# EAGLE schematic BMS Segment rev10 (EAGLE 9.2.2)
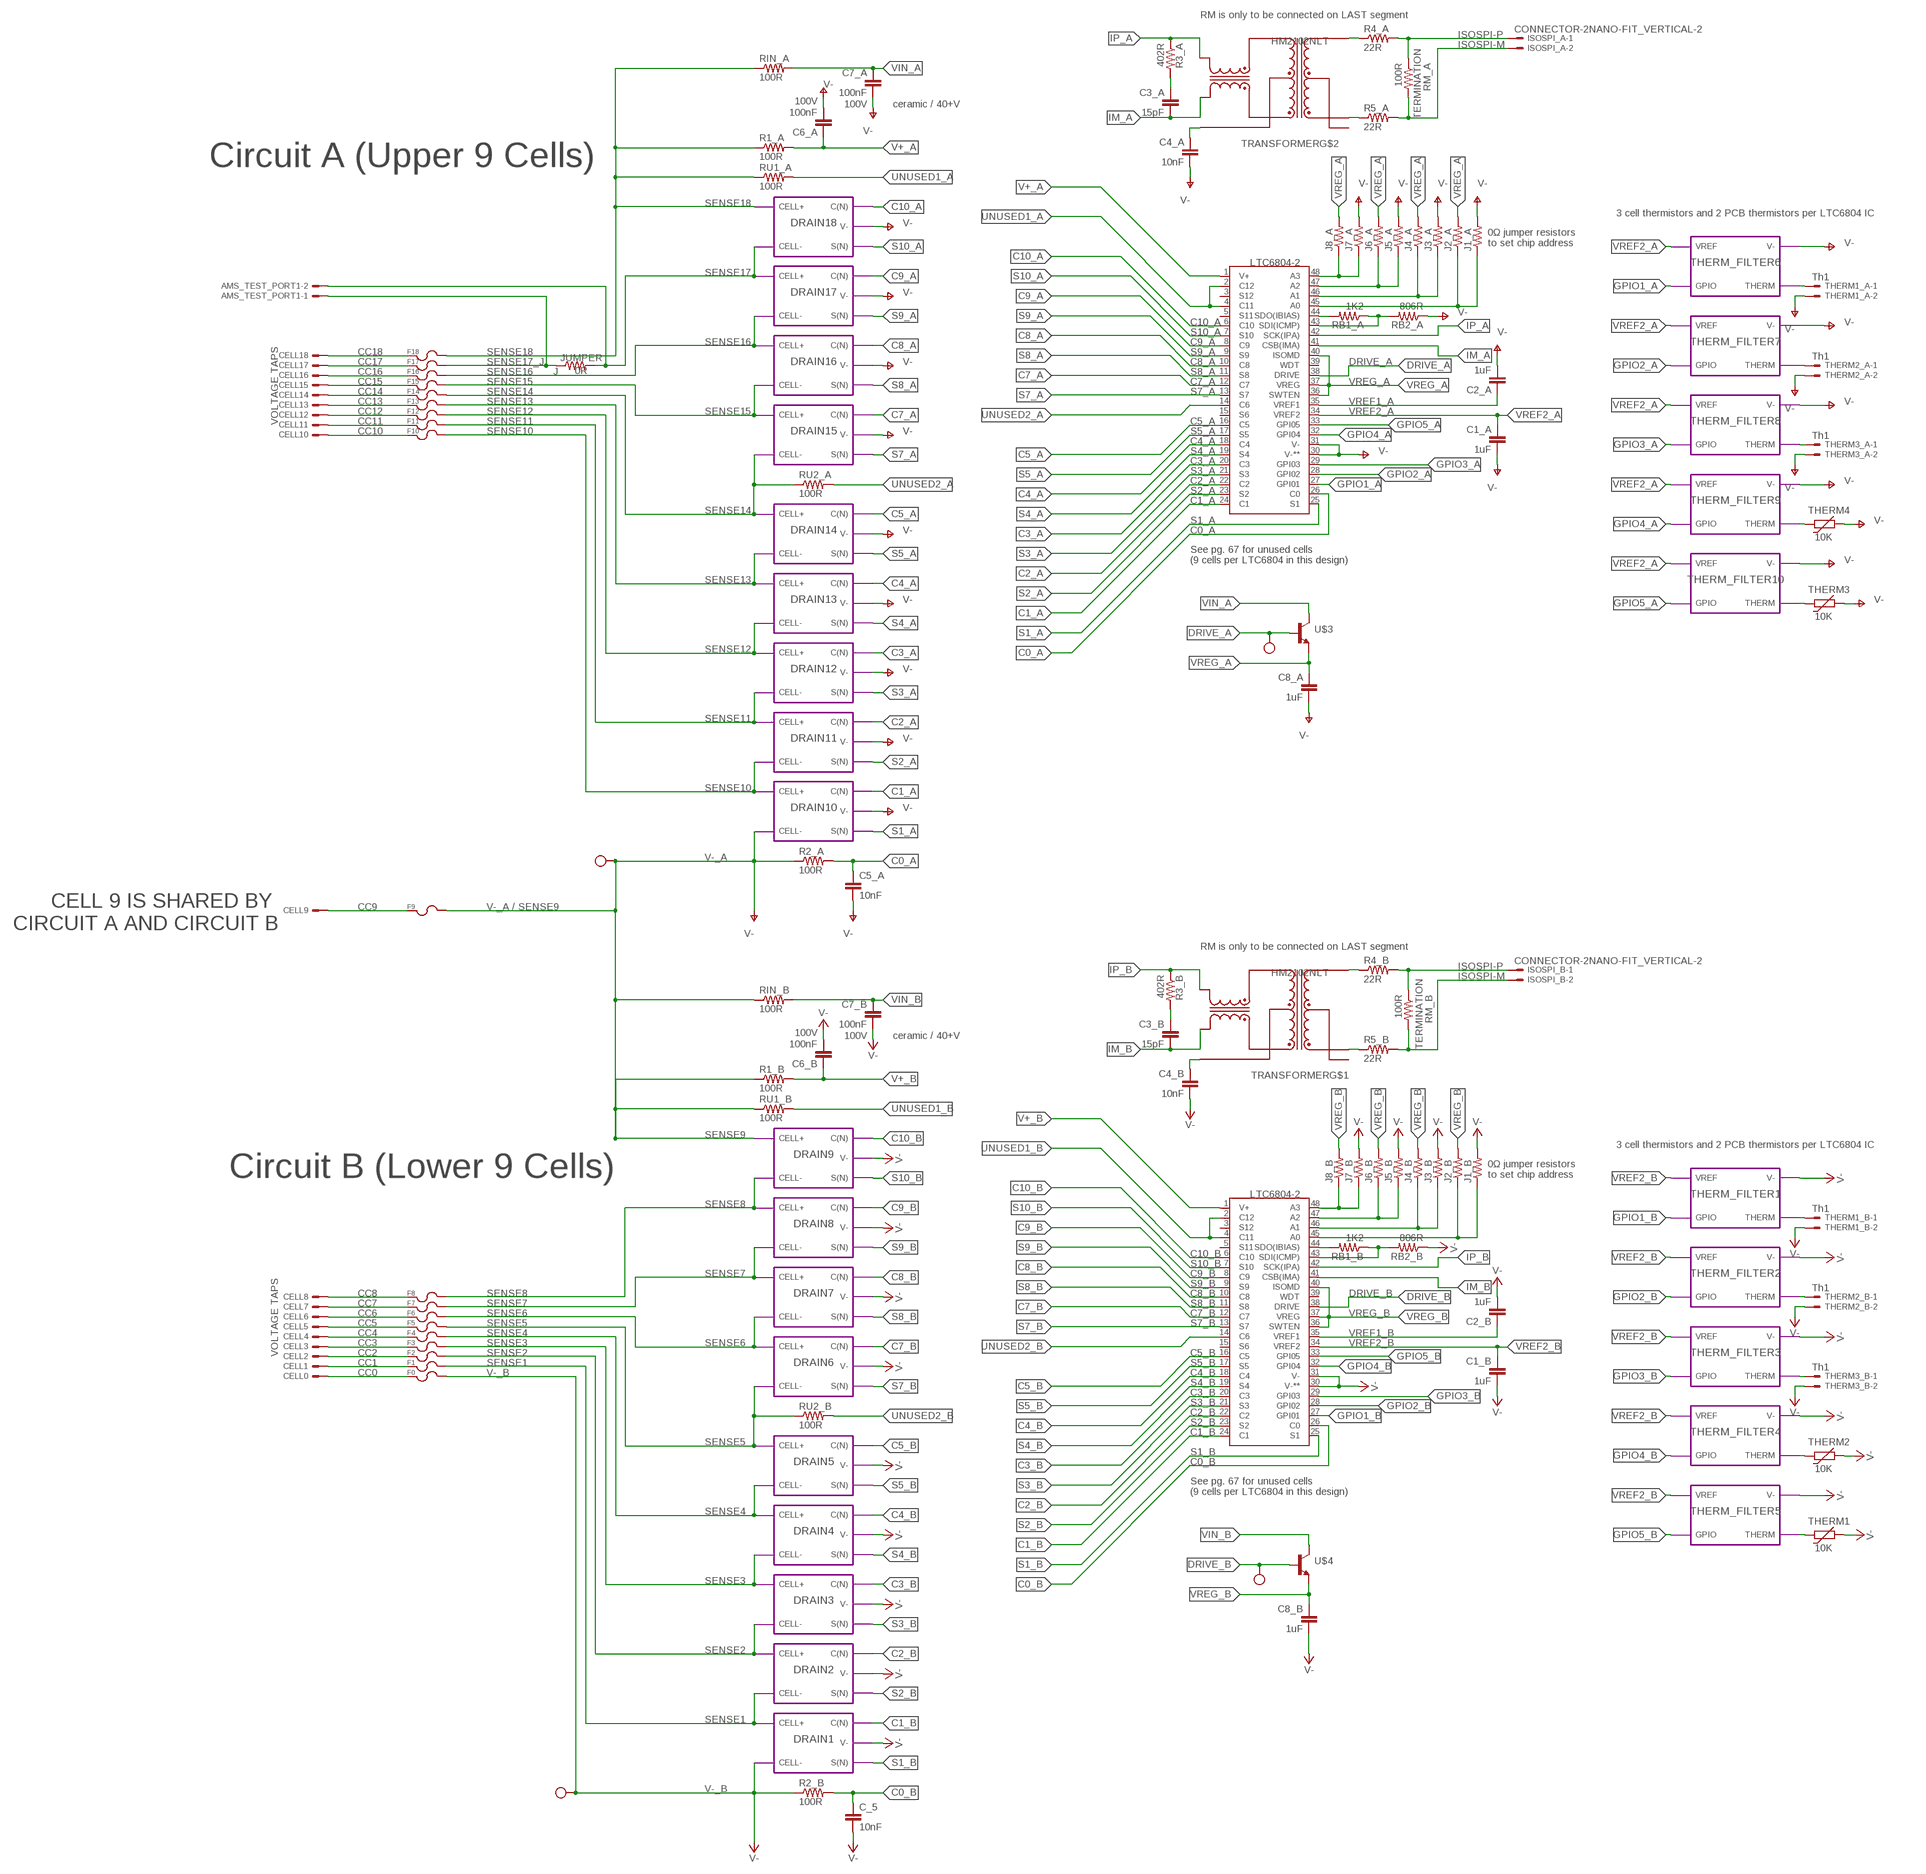
[diagram p0: schematic, sheet 1]

## Parts
AMS_TEST_PORT1  CONNECTOR-2NANO-FIT_VERTICAL-2  [NANO-FIT_VERTICAL-2]
C1_A  1uF  CAP0805  [0805]
C1_B  1uF  CAP0805  [0805]
C2_A  1uF  CAP0805  [0805]
C2_B  1uF  CAP0805  [0805]
C3_A  15pF  CAP0805  [0805]
C3_B  15pF  CAP0805  [0805]
C4_A  10nF  CAP0805  [0805]
C4_B  10nF  CAP0805  [0805]
C5_A  10nF  CAP0805  [0805]
C6_A  100nF  CAP0805  [0805]
C6_B  100nF  CAP0805  [0805]
C7_A  100nF  CAP0805  [0805]
C7_B  100nF  CAP0805  [0805]
C8_A  1uF  CAP0805  [0805]
C8_B  1uF  CAP0805  [0805]
C_5  10nF  CAP0805  [0805]
CELL0  BATTERY_SPRING_KEYSTONE5222  [KEYSTONE5222]
CELL1  BATTERY_SPRING_KEYSTONE5222  [KEYSTONE5222]
CELL2  BATTERY_SPRING_KEYSTONE5222  [KEYSTONE5222]
CELL3  BATTERY_SPRING_KEYSTONE5222  [KEYSTONE5222]
CELL4  BATTERY_SPRING_KEYSTONE5222  [KEYSTONE5222]
CELL5  BATTERY_SPRING_KEYSTONE5222  [KEYSTONE5222]
CELL6  BATTERY_SPRING_KEYSTONE5222  [KEYSTONE5222]
CELL7  BATTERY_SPRING_KEYSTONE5222  [KEYSTONE5222]
CELL8  BATTERY_SPRING_KEYSTONE5222  [KEYSTONE5222]
CELL9  BATTERY_SPRING_KEYSTONE5222  [KEYSTONE5222]
CELL10  BATTERY_SPRING_KEYSTONE5222  [KEYSTONE5222]
CELL11  BATTERY_SPRING_KEYSTONE5222  [KEYSTONE5222]
CELL12  BATTERY_SPRING_KEYSTONE5222  [KEYSTONE5222]
CELL13  BATTERY_SPRING_KEYSTONE5222  [KEYSTONE5222]
CELL14  BATTERY_SPRING_KEYSTONE5222  [KEYSTONE5222]
CELL15  BATTERY_SPRING_KEYSTONE5222  [KEYSTONE5222]
CELL16  BATTERY_SPRING_KEYSTONE5222  [KEYSTONE5222]
CELL17  BATTERY_SPRING_KEYSTONE5222  [KEYSTONE5222]
CELL18  BATTERY_SPRING_KEYSTONE5222  [KEYSTONE5222]
F0  0001.2704.11  [5X20MM_FUSE]
F1  0001.2704.11  [5X20MM_FUSE]
F2  0001.2704.11  [5X20MM_FUSE]
F3  0001.2704.11  [5X20MM_FUSE]
F4  0001.2704.11  [5X20MM_FUSE]
F5  0001.2704.11  [5X20MM_FUSE]
F6  0001.2704.11  [5X20MM_FUSE]
F7  0001.2704.11  [5X20MM_FUSE]
F8  0001.2704.11  [5X20MM_FUSE]
F9  0001.2704.11  [5X20MM_FUSE]
F10  0001.2704.11  [5X20MM_FUSE]
F11  0001.2704.11  [5X20MM_FUSE]
F12  0001.2704.11  [5X20MM_FUSE]
F13  0001.2704.11  [5X20MM_FUSE]
F14  0001.2704.11  [5X20MM_FUSE]
F15  0001.2704.11  [5X20MM_FUSE]
F16  0001.2704.11  [5X20MM_FUSE]
F17  0001.2704.11  [5X20MM_FUSE]
F18  0001.2704.11  [5X20MM_FUSE]
ISOSPI_A  CONNECTOR-2NANO-FIT_VERTICAL-2  [NANO-FIT_VERTICAL-2]
ISOSPI_B  CONNECTOR-2NANO-FIT_VERTICAL-2  [NANO-FIT_VERTICAL-2]
J  0R  RESISTOR0805-RES  [0805]
J1_A  RESISTOR0805-RES  [0805]
J1_B  RESISTOR0805-RES  [0805]
J2_A  RESISTOR0805-RES  [0805]
J2_B  RESISTOR0805-RES  [0805]
J3_A  RESISTOR0805-RES  [0805]
J3_B  RESISTOR0805-RES  [0805]
J4_A  RESISTOR0805-RES  [0805]
J4_B  RESISTOR0805-RES  [0805]
J5_A  RESISTOR0805-RES  [0805]
J5_B  RESISTOR0805-RES  [0805]
J6_A  RESISTOR0805-RES  [0805]
J6_B  RESISTOR0805-RES  [0805]
J7_A  RESISTOR0805-RES  [0805]
J7_B  RESISTOR0805-RES  [0805]
J8_A  RESISTOR0805-RES  [0805]
J8_B  RESISTOR0805-RES  [0805]
R1_A  100R  RESISTOR0805-RES  [0805]
R1_B  100R  RESISTOR0805-RES  [0805]
R2_A  100R  RESISTOR0805-RES  [0805]
R2_B  100R  RESISTOR0805-RES  [0805]
R3_A  402R  RESISTOR0805-RES  [0805]
R3_B  402R  RESISTOR0805-RES  [0805]
R4_A  22R  RESISTOR0805-RES  [0805]
R4_B  22R  RESISTOR0805-RES  [0805]
R5_A  22R  RESISTOR0805-RES  [0805]
R5_B  22R  RESISTOR0805-RES  [0805]
RB1_A  1K2  RESISTOR0805-RES  [0805]
RB1_B  1K2  RESISTOR0805-RES  [0805]
RB2_A  806R  RESISTOR0805-RES  [0805]
RB2_B  806R  RESISTOR0805-RES  [0805]
RIN_A  100R  RESISTOR0805-RES  [0805]
RIN_B  100R  RESISTOR0805-RES  [0805]
RM_A  100R  RESISTOR0805-RES  [0805]
RM_B  100R  RESISTOR0805-RES  [0805]
RU1_A  100R  RESISTOR0805-RES  [0805]
RU1_B  100R  RESISTOR0805-RES  [0805]
RU2_A  100R  RESISTOR0805-RES  [0805]
RU2_B  100R  RESISTOR0805-RES  [0805]
THERM1  10K  THERMISTOR_NCP210603  [0603]
THERM1_A  Th1  CONNECTOR-2NANO-FIT_VERTICAL-2  [NANO-FIT_VERTICAL-2]
THERM1_B  Th1  CONNECTOR-2NANO-FIT_VERTICAL-2  [NANO-FIT_VERTICAL-2]
THERM2  10K  THERMISTOR_NCP210603  [0603]
THERM2_A  Th1  CONNECTOR-2NANO-FIT_VERTICAL-2  [NANO-FIT_VERTICAL-2]
THERM2_B  Th1  CONNECTOR-2NANO-FIT_VERTICAL-2  [NANO-FIT_VERTICAL-2]
THERM3  10K  THERMISTOR_NCP210603  [0603]
THERM3_A  Th1  CONNECTOR-2NANO-FIT_VERTICAL-2  [NANO-FIT_VERTICAL-2]
THERM3_B  Th1  CONNECTOR-2NANO-FIT_VERTICAL-2  [NANO-FIT_VERTICAL-2]
THERM4  10K  THERMISTOR_NCP210603  [0603]
TRANSFORMER  HM2102NLT  [HM2102NLT]
U$1  LTC6804-2  [LTC6804]
U$2  LTC6804-2  [LTC6804]
U$3  NSV1C201MZ4  [SOT223]
U$4  NSV1C201MZ4  [SOT223]
U$5  TEST_POINT  [TEST_POINT]
U$6  TEST_POINT  [TEST_POINT]
U$7  TEST_POINT  [TEST_POINT]
U$8  TEST_POINT  [TEST_POINT]

## Module instances
DRAIN1 = DRAIN+FILTER
DRAIN2 = DRAIN+FILTER
DRAIN3 = DRAIN+FILTER
DRAIN4 = DRAIN+FILTER
DRAIN5 = DRAIN+FILTER
DRAIN6 = DRAIN+FILTER
DRAIN7 = DRAIN+FILTER
DRAIN8 = DRAIN+FILTER
DRAIN9 = DRAIN+FILTER
THERM_FILTER1 = THERM_FILTER
THERM_FILTER2 = THERM_FILTER
THERM_FILTER3 = THERM_FILTER
THERM_FILTER4 = THERM_FILTER
THERM_FILTER5 = THERM_FILTER
DRAIN10 = DRAIN+FILTER
DRAIN11 = DRAIN+FILTER
DRAIN12 = DRAIN+FILTER
DRAIN13 = DRAIN+FILTER
DRAIN14 = DRAIN+FILTER
DRAIN15 = DRAIN+FILTER
DRAIN16 = DRAIN+FILTER
DRAIN17 = DRAIN+FILTER
DRAIN18 = DRAIN+FILTER
THERM_FILTER6 = THERM_FILTER
THERM_FILTER7 = THERM_FILTER
THERM_FILTER8 = THERM_FILTER
THERM_FILTER9 = THERM_FILTER
THERM_FILTER10 = THERM_FILTER

## Nets
C0_A: C5_A.1 R2_A.2 U$1.26(C0)
C0_B: C_5.1 R2_B.2 U$2.26(C0)
C1_A: U$1.24(C1) ; port DRAIN10.C(N)
C1_B: U$2.24(C1) ; port DRAIN1.C(N)
C2_A: U$1.22(C2) ; port DRAIN11.C(N)
C2_B: U$2.22(C2) ; port DRAIN2.C(N)
C3_A: U$1.20(C3) ; port DRAIN12.C(N)
C3_B: U$2.20(C3) ; port DRAIN3.C(N)
C4_A: U$1.18(C4) ; port DRAIN13.C(N)
C4_B: U$2.18(C4) ; port DRAIN4.C(N)
C5_A: U$1.16(C5) ; port DRAIN14.C(N)
C5_B: U$2.16(C5) ; port DRAIN5.C(N)
C7_A: U$1.12(C7) ; port DRAIN15.C(N)
C7_B: U$2.12(C7) ; port DRAIN6.C(N)
C8_A: U$1.10(C8) ; port DRAIN16.C(N)
C8_B: U$2.10(C8) ; port DRAIN7.C(N)
C9_A: U$1.8(C9) ; port DRAIN17.C(N)
C9_B: U$2.8(C9) ; port DRAIN8.C(N)
C10_A: U$1.6(C10) ; port DRAIN18.C(N)
C10_B: U$2.6(C10) ; port DRAIN9.C(N)
CC0 [unfused_hv]: CELL0.P$1(S) F0.P$1
CC1 [unfused_hv]: CELL1.P$1(S) F1.P$1
CC2 [unfused_hv]: CELL2.P$1(S) F2.P$1
CC3 [unfused_hv]: CELL3.P$1(S) F3.P$1
CC4 [unfused_hv]: CELL4.P$1(S) F4.P$1
CC5 [unfused_hv]: CELL5.P$1(S) F5.P$1
CC6 [unfused_hv]: CELL6.P$1(S) F6.P$1
CC7 [unfused_hv]: CELL7.P$1(S) F7.P$1
CC8 [unfused_hv]: CELL8.P$1(S) F8.P$1
CC9 [unfused_hv]: CELL9.P$1(S) F9.P$1
CC10 [unfused_hv]: CELL10.P$1(S) F10.P$1
CC11 [unfused_hv]: CELL11.P$1(S) F11.P$1
CC12 [unfused_hv]: CELL12.P$1(S) F12.P$1
CC13 [unfused_hv]: CELL13.P$1(S) F13.P$1
CC14 [unfused_hv]: CELL14.P$1(S) F14.P$1
CC15 [unfused_hv]: CELL15.P$1(S) F15.P$1
CC16 [unfused_hv]: CELL16.P$1(S) F16.P$1
CC17 [unfused_hv]: CELL17.P$1(S) F17.P$1
CC18 [unfused_hv]: CELL18.P$1(S) F18.P$1
DRIVE_A: U$1.38(DRIVE) U$3.1(BASE) U$8.P$1
DRIVE_B: U$2.38(DRIVE) U$4.1(BASE) U$7.P$1
GPIO1_A: U$1.27(GPI01) ; port THERM_FILTER6.GPIO
GPIO1_B: U$2.27(GPI01) ; port THERM_FILTER1.GPIO
GPIO2_A: U$1.28(GPI02) ; port THERM_FILTER7.GPIO
GPIO2_B: U$2.28(GPI02) ; port THERM_FILTER2.GPIO
GPIO3_A: U$1.29(GPI03) ; port THERM_FILTER8.GPIO
GPIO3_B: U$2.29(GPI03) ; port THERM_FILTER3.GPIO
GPIO4_A: U$1.32(GPI04) ; port THERM_FILTER9.GPIO
GPIO4_B: U$2.32(GPI04) ; port THERM_FILTER4.GPIO
GPIO5_A: U$1.33(GPI05) ; port THERM_FILTER10.GPIO
GPIO5_B: U$2.33(GPI05) ; port THERM_FILTER5.GPIO
IM_A: C3_A.2 TRANSFORMER.P$9(TD+) U$1.41(CSB(IMA))
IM_B: C3_B.2 TRANSFORMER.P$12(TD+) U$2.41(CSB(IMA))
IP_A: R3_A.1 TRANSFORMER.P$7(TD-) U$1.42(SCK(IPA))
IP_B: R3_B.1 TRANSFORMER.P$10(TD-) U$2.42(SCK(IPA))
ISOSPI-M: ISOSPI_A.P$2 ISOSPI_B.P$2 R5_A.2 R5_B.2 RM_A.2 RM_B.2
ISOSPI-P: ISOSPI_A.P$1 ISOSPI_B.P$1 R4_A.2 R4_B.2 RM_A.1 RM_B.1
N$1: C4_B.1 TRANSFORMER.P$11(TCT)
N$2: RB1_B.2 U$2.44(SDO(IBIAS))
N$3: THERM1_B.P$1 ; port THERM_FILTER1.THERM
N$4: RB1_B.1 RB2_B.2 U$2.43(SDI(ICMP))
N$5: R4_B.1 TRANSFORMER.P$3(MX-)
N$6: RB1_A.2 U$1.44(SDO(IBIAS))
N$7: R5_B.1 TRANSFORMER.P$1(MX+)
N$8: J7_B.1 J8_B.1 U$2.48(A3)
N$9: J5_B.1 J6_B.1 U$2.47(A2)
N$10: C3_B.1 R3_B.2
N$13: J3_B.1 J4_B.1 U$2.46(A1)
N$16: J1_B.1 J2_B.1 U$2.45(A0)
N$17: THERM1.2 ; port THERM_FILTER5.THERM
N$18: THERM2_B.P$1 ; port THERM_FILTER2.THERM
N$19: THERM2.2 ; port THERM_FILTER4.THERM
N$20: RB1_A.1 RB2_A.2 U$1.43(SDI(ICMP))
N$21: C4_A.1 TRANSFORMER.P$8(TCT)
N$22: R4_A.1 TRANSFORMER.P$6(MX-)
N$23: R5_A.1 TRANSFORMER.P$4(MX+)
N$24: C3_A.1 R3_A.2
N$26: THERM3_B.P$1 ; port THERM_FILTER3.THERM
N$30: J7_A.1 J8_A.1 U$1.48(A3)
N$31: J5_A.1 J6_A.1 U$1.47(A2)
N$32: J3_A.1 J4_A.1 U$1.46(A1)
N$33: J1_A.1 J2_A.1 U$1.45(A0)
N$34: THERM4.2 ; port THERM_FILTER9.THERM
N$35: THERM3_A.P$1 ; port THERM_FILTER8.THERM
N$36: THERM3.2 ; port THERM_FILTER10.THERM
N$37: THERM2_A.P$1 ; port THERM_FILTER7.THERM
N$38: THERM1_A.P$1 ; port THERM_FILTER6.THERM
S1_A: U$1.25(S1) ; port DRAIN10.S(N)
S1_B: U$2.25(S1) ; port DRAIN1.S(N)
S2_A: U$1.23(S2) ; port DRAIN11.S(N)
S2_B: U$2.23(S2) ; port DRAIN2.S(N)
S3_A: U$1.21(S3) ; port DRAIN12.S(N)
S3_B: U$2.21(S3) ; port DRAIN3.S(N)
S4_A: U$1.19(S4) ; port DRAIN13.S(N)
S4_B: U$2.19(S4) ; port DRAIN4.S(N)
S5_A: U$1.17(S5) ; port DRAIN14.S(N)
S5_B: U$2.17(S5) ; port DRAIN5.S(N)
S7_A: U$1.13(S7) ; port DRAIN15.S(N)
S7_B: U$2.13(S7) ; port DRAIN6.S(N)
S8_A: U$1.11(S8) ; port DRAIN16.S(N)
S8_B: U$2.11(S8) ; port DRAIN7.S(N)
S9_A: U$1.9(S9) ; port DRAIN17.S(N)
S9_B: U$2.9(S9) ; port DRAIN8.S(N)
S10_A: U$1.7(S10) ; port DRAIN18.S(N)
S10_B: U$2.7(S10) ; port DRAIN9.S(N)
SENSE1: F1.P$2 ; port DRAIN1.CELL+ DRAIN2.CELL-
SENSE2: F2.P$2 ; port DRAIN2.CELL+ DRAIN3.CELL-
SENSE3: F3.P$2 ; port DRAIN3.CELL+ DRAIN4.CELL-
SENSE4: F4.P$2 ; port DRAIN4.CELL+ DRAIN5.CELL-
SENSE5: F5.P$2 RU2_B.1 ; port DRAIN5.CELL+ DRAIN6.CELL-
SENSE6: F6.P$2 ; port DRAIN6.CELL+ DRAIN7.CELL-
SENSE7: F7.P$2 ; port DRAIN7.CELL+ DRAIN8.CELL-
SENSE8: F8.P$2 ; port DRAIN8.CELL+ DRAIN9.CELL-
SENSE10: F10.P$2 ; port DRAIN10.CELL+ DRAIN11.CELL-
SENSE11: F11.P$2 ; port DRAIN11.CELL+ DRAIN12.CELL-
SENSE12: F12.P$2 ; port DRAIN12.CELL+ DRAIN13.CELL-
SENSE13: F13.P$2 ; port DRAIN13.CELL+ DRAIN14.CELL-
SENSE14: F14.P$2 RU2_A.1 ; port DRAIN14.CELL+ DRAIN15.CELL-
SENSE15: F15.P$2 ; port DRAIN15.CELL+ DRAIN16.CELL-
SENSE16: F16.P$2 ; port DRAIN16.CELL+ DRAIN17.CELL-
SENSE17: AMS_TEST_PORT1.P$2 J.2 ; port DRAIN17.CELL+ DRAIN18.CELL-
SENSE17_J: AMS_TEST_PORT1.P$1 F17.P$2 J.1
SENSE18: F18.P$2 R1_A.1 RIN_A.1 RU1_A.1 ; port DRAIN18.CELL+
UNUSED1_A: RU1_A.2 U$1.2(C12) U$1.4(C11)
UNUSED1_B: RU1_B.2 U$2.2(C12) U$2.4(C11)
UNUSED2_A: RU2_A.2 U$1.14(C6)
UNUSED2_B: RU2_B.2 U$2.14(C6)
V+_A: C6_A.1 R1_A.2 U$1.1(V+)
V+_B: C6_B.1 R1_B.2 U$2.1(V+)
V-_A: C1_A.2 C2_A.2 C4_A.2 C5_A.2 C6_A.2 C7_A.2 C8_A.2 F9.P$2 J1_A.2 J3_A.2 J5_A.2 J7_A.2 R1_B.1 R2_A.1 RB2_A.1 RIN_B.1 RU1_B.1 THERM1_A.P$2 THERM2_A.P$2 THERM3.1 THERM3_A.P$2 THERM4.1 U$1.30(V-**) U$1.31(V-) U$5.P$1 ; port DRAIN10.CELL- DRAIN9.CELL+ DRAIN18.V- DRAIN17.V- DRAIN16.V- DRAIN15.V- DRAIN14.V- DRAIN13.V- DRAIN12.V- DRAIN11.V- DRAIN10.V- THERM_FILTER6.V- THERM_FILTER7.V- THERM_FILTER8.V- THERM_FILTER9.V- THERM_FILTER10.V- ; supply symbol labelled V-
V-_B: C1_B.2 C2_B.2 C4_B.2 C6_B.2 C7_B.2 C8_B.2 C_5.2 F0.P$2 J1_B.2 J3_B.2 J5_B.2 J7_B.2 R2_B.1 RB2_B.1 THERM1.1 THERM1_B.P$2 THERM2.1 THERM2_B.P$2 THERM3_B.P$2 U$2.30(V-**) U$2.31(V-) U$6.P$1 ; port DRAIN1.CELL- DRAIN9.V- DRAIN8.V- DRAIN7.V- DRAIN6.V- DRAIN5.V- DRAIN4.V- DRAIN3.V- DRAIN2.V- DRAIN1.V- THERM_FILTER1.V- THERM_FILTER2.V- THERM_FILTER3.V- THERM_FILTER4.V- THERM_FILTER5.V- ; supply symbol labelled V-
VIN_A: C7_A.1 RIN_A.2 U$3.2(COLLECTOR) U$3.4(COLLECTOR)
VIN_B: C7_B.1 RIN_B.2 U$4.2(COLLECTOR) U$4.4(COLLECTOR)
VREF1_A: C2_A.1 U$1.35(VREF1)
VREF1_B: C2_B.1 U$2.35(VREF1)
VREF2_A: C1_A.1 U$1.34(VREF2) ; port THERM_FILTER6.VREF THERM_FILTER7.VREF THERM_FILTER8.VREF THERM_FILTER9.VREF THERM_FILTER10.VREF
VREF2_B: C1_B.1 U$2.34(VREF2) ; port THERM_FILTER4.VREF THERM_FILTER5.VREF THERM_FILTER3.VREF THERM_FILTER2.VREF THERM_FILTER1.VREF
VREG_A: C8_A.1 J2_A.2 J4_A.2 J6_A.2 J8_A.2 U$1.36(SWTEN) U$1.37(VREG) U$1.40(ISOMD) U$3.3(EMITTER)
VREG_B: C8_B.1 J2_B.2 J4_B.2 J6_B.2 J8_B.2 U$2.36(SWTEN) U$2.37(VREG) U$2.40(ISOMD) U$4.3(EMITTER)
Unconnected: TRANSFORMER.P$2(MCT) TRANSFORMER.P$5(MCT) U$1.3(S12) U$1.5(S11) U$1.15(S6) U$1.39(WDT) U$2.3(S12) U$2.5(S11) U$2.15(S6) U$2.39(WDT)

## Notes on the sheet
- RM is only to be connected on LAST segment
- ceramic / 40+V
- Circuit A (Upper 9 Cells)
- 3 cell thermistors and 2 PCB thermistors per LTC6804 IC
- 0Ω jumper resistors
  to set chip address
- LTC6804-2
- VOLTAGE TAPS
- See pg. 67 for unused cells
  (9 cells per LTC6804 in this design)
- V-_A / SENSE9
- CELL 9 IS SHARED BY 
  CIRCUIT A AND CIRCUIT B
- RM is only to be connected on LAST segment
- ceramic / 40+V
- SENSE9
- 3 cell thermistors and 2 PCB thermistors per LTC6804 IC
- Circuit B (Lower 9 Cells)
- 0Ω jumper resistors
  to set chip address
- LTC6804-2
- VOLTAGE TAPS
- See pg. 67 for unused cells
  (9 cells per LTC6804 in this design)

## Library data of the parts
AMS_TEST_PORT1 ISOSPI_A ISOSPI_B THERM1_A THERM1_B THERM2_A THERM2_B THERM3_A THERM3_B = HyTechDevices:CONNECTOR-2: Mini-Fit Junior connector 2 pole Source: http://www.molex.com
C1_A C1_B C2_A C2_B C3_A C3_B C4_A C4_B C5_A C8_A C8_B C_5 = HyTechDevices:CAP: Capacitor Standard 0603 ceramic capacitor, and 0.1" leaded capacitor.
C6_A C6_B C7_A C7_B = HyTechDevices:CAP: Capacitor Standard 0603 ceramic capacitor, and 0.1" leaded capacitor.; VOLTAGE: 100V
CELL0 CELL1-CELL18 = HyTechDevices:BATTERY_SPRING: Keystone Electronics Battery Spring Contact Datasheet <http://keyelco.com/userAssets/file/M65p17.pdf>
F0 F1-F18 = HyTechDevices:0001.2704.11: Schurter Surface Mount Ceramic Fuse Current Rating: 1A Voltage Rating AC: 250 VAC Voltage Rating DC: 300 VDC Dimensions: 5 mm x 20 mm Datasheet <http://www.mouser.com/ds/2/358/typ_SMD-SPT-46594.pdf>
J = HyTechDevices:RESISTOR: Resistor Basic schematic elements and footprints for 0603, 1206, and PTH resistors.; TYPE: JUMPER
J1_A J1_B J2_A J2_B J3_A J3_B J4_A J4_B J5_A J5_B J6_A J6_B J7_A J7_B J8_A J8_B R1_A R1_B R2_A R2_B R3_A R3_B R4_A R4_B R5_A R5_B RB1_A RB1_B RB2_A RB2_B RIN_A RIN_B RU1_A RU1_B RU2_A RU2_B = HyTechDevices:RESISTOR: Resistor Basic schematic elements and footprints for 0603, 1206, and PTH resistors.
RM_A RM_B = HyTechDevices:RESISTOR: Resistor Basic schematic elements and footprints for 0603, 1206, and PTH resistors.; TYPE: TERMINATION
THERM1-THERM4 = HyTechDevices:THERMISTOR_NCP21: Murata NCP Thermistor Datasheet <http://www.murata.com/~/media/webrenewal/support/library/catalog/products/thermistor/ntc/r44e.ashx>
TRANSFORMER = HyTechDevices:HM2102NLT: 2 Channel SMT Transformer Turns ratio: 1CT: 1CT Isolation Voltage: 4300 VDC Inductance: 150 uH Leakage Inductance: 0.50 uH max DataSheet <https://www.mouser.com/datasheet/2/336/HM2102NL-1218600.pdf>
U$1 U$2 = HyTechDevices:LTC6804-2: Linear Technology Multicell Battery Stack Monitor Variant 2: Addressable/Multi-Drop Configuration Datasheet <http://cds.linear.com/docs/en/datasheet/680412fc.pdf>
U$3 U$4 = HyTechDevices:NSV1C201MZ4: NPN Transistor Datasheet <http://www.onsemi.com/pub/Collateral/NSS1C201MZ4-D.PDF> MAX current: 2.0A MAX voltage: 100V
U$5-U$8 = HyTechDevices:TEST_POINT: Keystone Electronics Test Point 5005

## Module DRAIN+FILTER
Ports: CELL+(in) CELL-(out) S(N)(in) C(N)(out) V-(pwr)
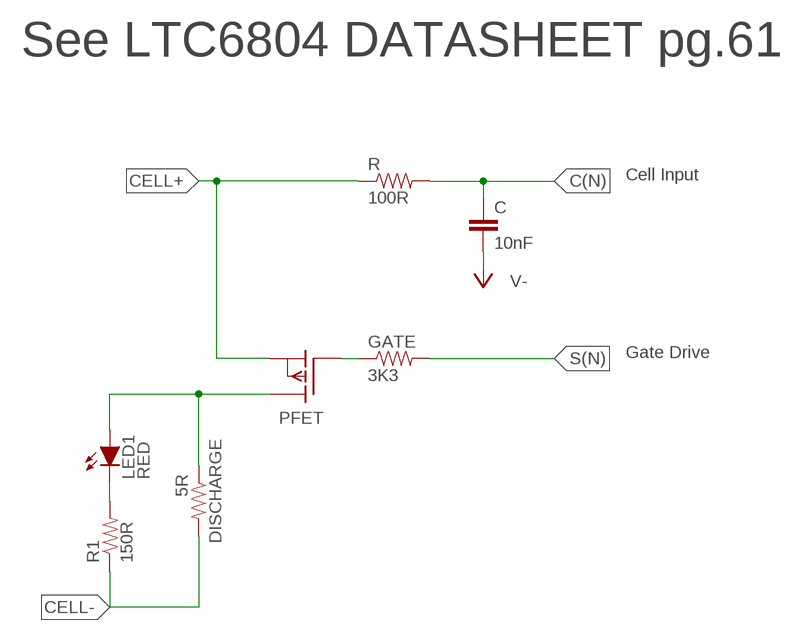
[diagram p1: schematic, module DRAIN+FILTER, sheet 1]

### Parts
C  10nF  CAP0805  [0805]
DISCHARGE  5R  RESISTORPWR163  [PWR163]
GATE  3K3  RESISTOR0805-RES  [0805]
LED1  RED  LED-0805  [LED-805]
PFET  P-CHANNEL_MOSFET_DMP3099L-7  [SOT23]
R  100R  RESISTOR0805-RES  [0805]
R1  150R  RESISTOR0805-RES  [0805]

### Nets
C(N): C.1 R.2
CELL+: PFET.2(S) R.1
CELL-: DISCHARGE.2 R1.1
GATE: GATE.1 PFET.1(G)
N$1: DISCHARGE.1 LED1.A PFET.3(D)
N$2: LED1.C R1.2
S(N): GATE.2
V-: C.2

### Notes on the sheet
- See LTC6804 DATASHEET pg.61
- Cell Input
- Gate Drive

### Library data of the parts
C = HyTechDevices:CAP: Capacitor Standard 0603 ceramic capacitor, and 0.1" leaded capacitor.
DISCHARGE GATE R R1 = HyTechDevices:RESISTOR: Resistor Basic schematic elements and footprints for 0603, 1206, and PTH resistors.
LED1 = HyTechDevices:LED: Light Emitting Diode (LED) Source: Dangerous Prototypes Eagle Library <https://github.com/DangerousPrototypes/Eagle_Part_Library>
PFET = HyTechDevices:P-CHANNEL_MOSFET_DMP3099L-7: Diodes Incorporated P-Channel Enhancement Mode MOSFET Datasheet <http://www.mouser.com/ds/2/115/DMP3099L-266220.pdf>

## Module THERM_FILTER
Ports: VREF(pwr) GPIO(out) THERM(nc) V-(pwr)
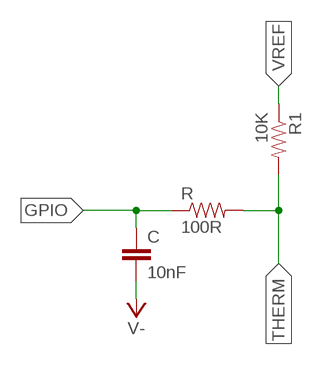
[diagram p2: schematic, module THERM_FILTER, sheet 1]

### Parts
C  10nF  CAP0805  [0805]
R  100R  RESISTOR0805-RES  [0805]
R1  10K  RESISTOR0805-RES  [0805]

### Nets
GPIO: C.1 R.1
THERM: R1.2 R.2
V-: C.2
VREF: R1.1

### Library data of the parts
C = HyTechDevices:CAP: Capacitor Standard 0603 ceramic capacitor, and 0.1" leaded capacitor.
R R1 = HyTechDevices:RESISTOR: Resistor Basic schematic elements and footprints for 0603, 1206, and PTH resistors.

## Net classes
1 unfused_hv: clearance 0.025 mm to class 0, clearance 3.2 mm